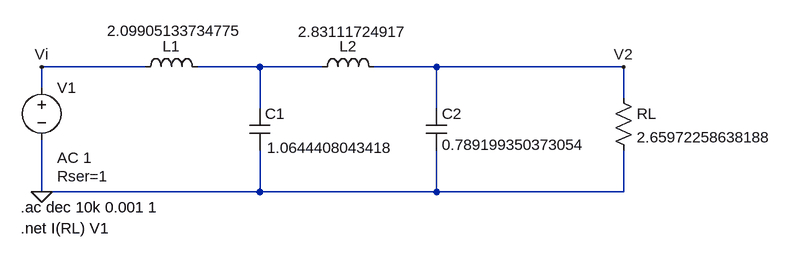
[diagram p0: schematic Normalizado.asc]
Normalizado.asc, the LTspice schematic file:
Version 4
SHEET 1 1116 680
WIRE 128 128 -32 128
WIRE 304 128 208 128
WIRE 400 128 304 128
WIRE 576 128 480 128
WIRE 864 128 576 128
WIRE -32 160 -32 128
WIRE 864 176 864 128
WIRE 304 192 304 128
WIRE 576 192 576 128
WIRE -32 320 -32 240
WIRE 304 320 304 256
WIRE 304 320 -32 320
WIRE 576 320 576 256
WIRE 576 320 304 320
WIRE 864 320 864 256
WIRE 864 320 576 320
FLAG -32 320 0
FLAG 864 128 V2
FLAG -32 128 Vi
SYMBOL voltage -32 144 R0
WINDOW 123 24 124 Left 2
WINDOW 39 24 152 Left 2
SYMATTR Value2 AC 1
SYMATTR SpiceLine Rser=1
SYMATTR InstName V1
SYMATTR Value ""
SYMBOL ind 112 144 R270
WINDOW 0 32 56 VTop 2
WINDOW 3 87 62 VBottom 2
SYMATTR InstName L1
SYMATTR Value 2.09905133734775
SYMBOL ind 384 144 R270
WINDOW 0 32 56 VTop 2
WINDOW 3 86 63 VBottom 2
SYMATTR InstName L2
SYMATTR Value 2.83111724917
SYMBOL cap 288 192 R0
WINDOW 3 27 60 Left 2
SYMATTR Value 1.0644408043418
SYMATTR InstName C1
SYMBOL cap 560 192 R0
SYMATTR InstName C2
SYMATTR Value 0.789199350373054
SYMBOL res 848 160 R0
SYMATTR InstName RL
SYMATTR Value 2.65972258638188
TEXT -64 344 Left 2 !.ac dec 10k 0.001 1
TEXT -64 376 Left 2 !.net I(RL) V1

The netlist it stands for:
* Normalizado.asc
V1 Vi 0 AC 1 Rser=1
L1 Vi N001 2.09905133734775
L2 N001 V2 2.83111724917
C1 N001 0 1.0644408043418
C2 V2 0 0.789199350373054
RL V2 0 2.65972258638188
.ac dec 10k 0.001 1
.net I(RL) V1
.backanno
.end